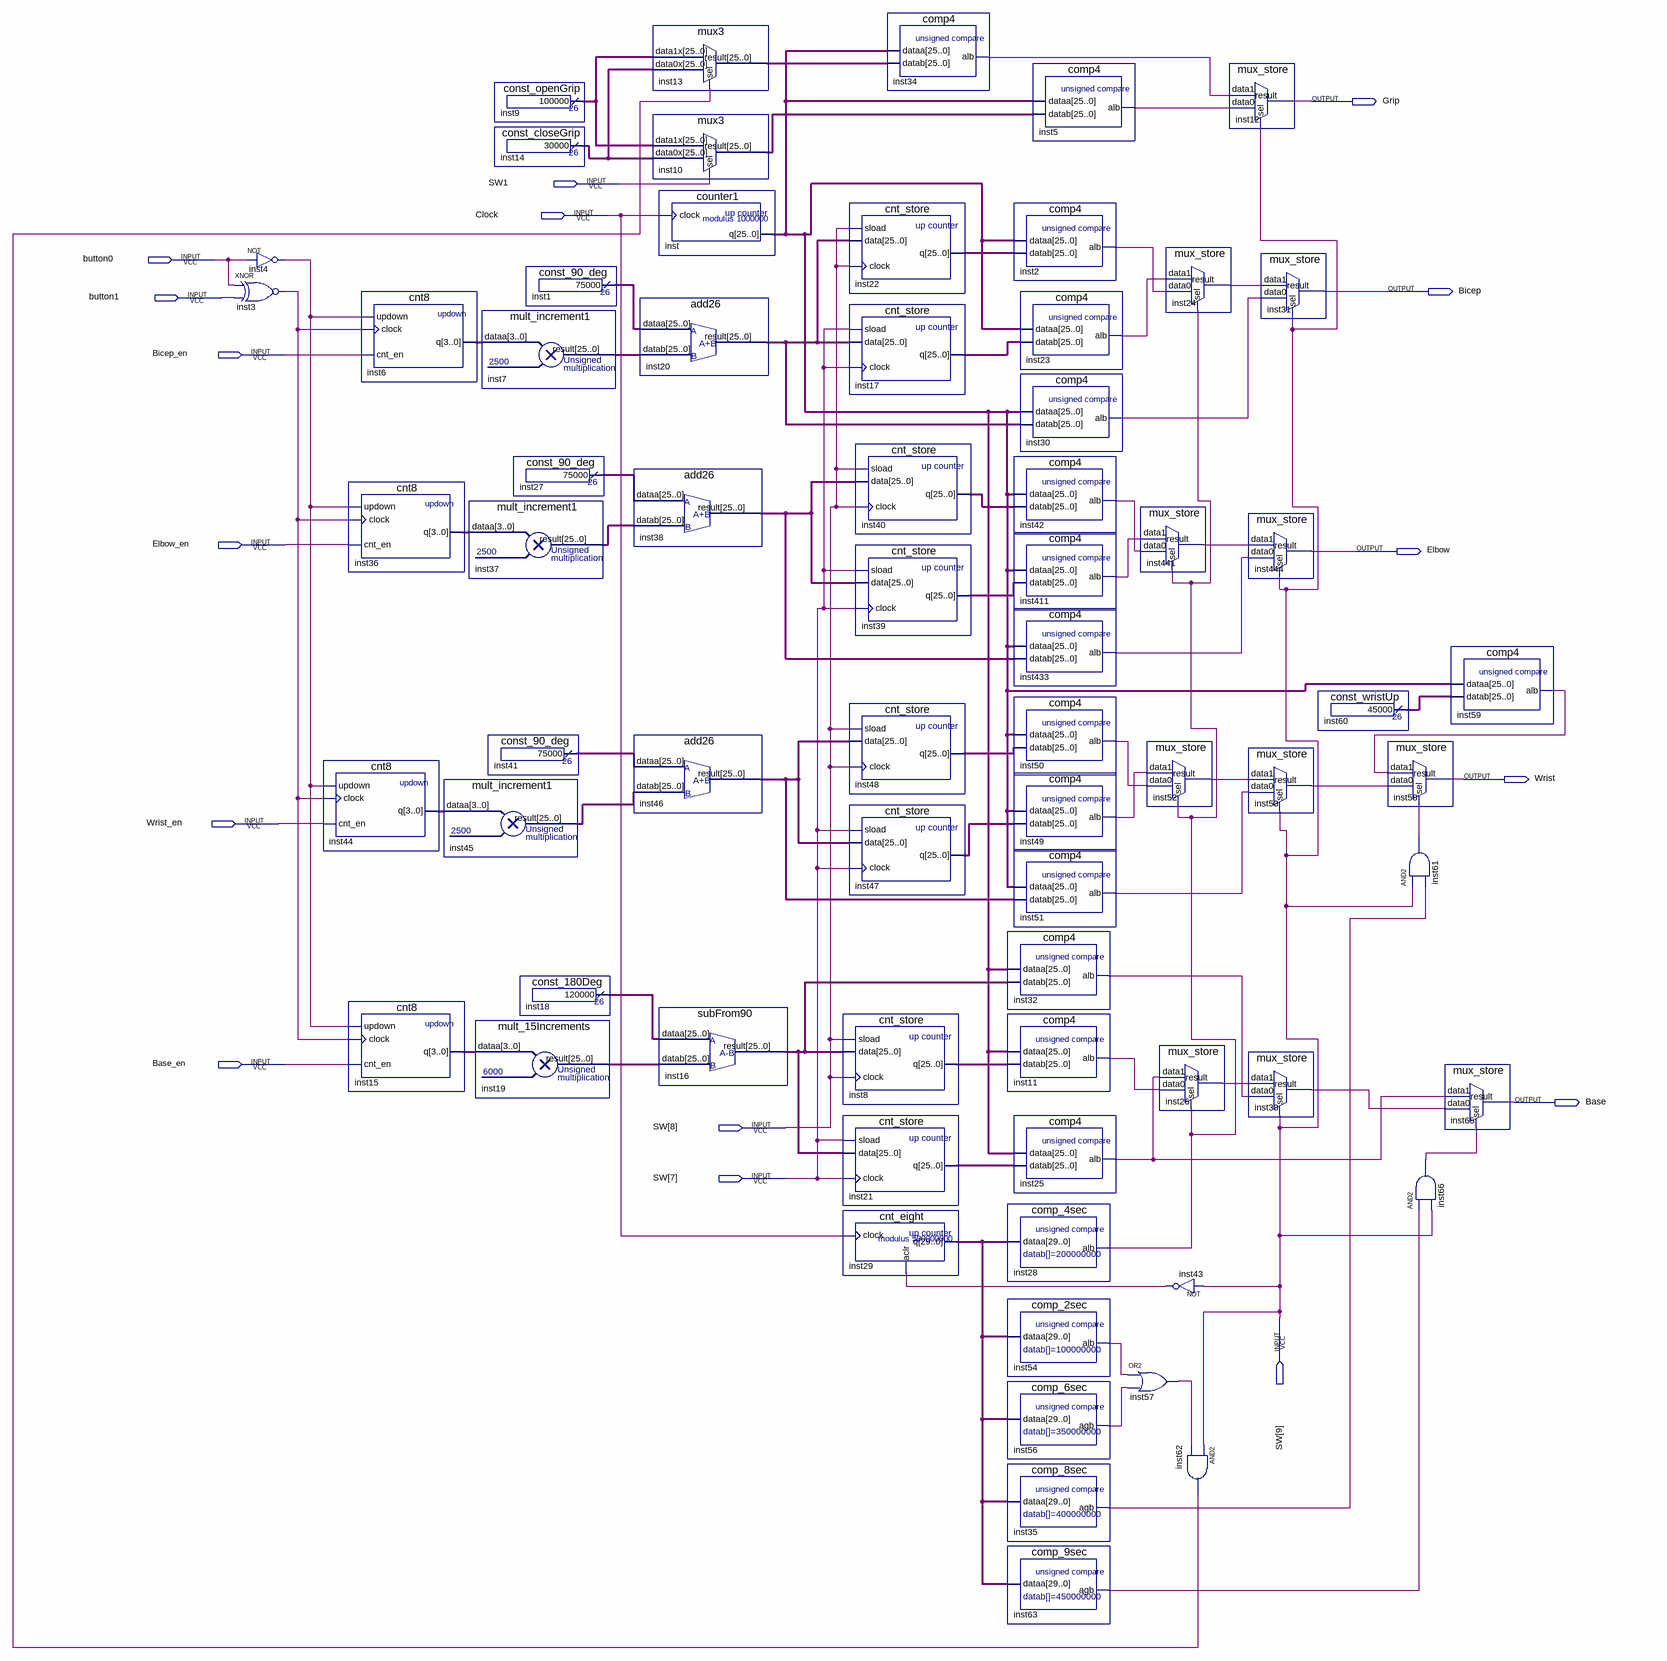
[diagram p0: schematic sheet]
// Quartus schematic pwm.bdf as structural Verilog: 69 symbols, 16 pins
module pwm (
  input  SW1,
  input  Clock,
  input  button0,
  input  button1,
  input  Bicep_en,
  input  Elbow_en,
  input  Wrist_en,
  input  Base_en,
  input  [9:7] SW,
  output Grip,
  output Bicep,
  output Elbow,
  output Wrist,
  output Base
);

  wire inst2_alb, inst3_out, inst4_out, inst5_alb, inst11_alb, inst23_alb, inst24_result, inst25_alb,
       inst26_result, inst28_alb, inst30_alb, inst32_alb, inst33_result, inst34_alb, inst35_agb, inst42_alb,
       inst43_out, inst49_alb, inst50_alb, inst51_alb, inst52_result, inst53_result, inst54_alb, inst56_agb,
       inst57_out, inst59_alb, inst61_out, inst62_out, inst63_agb, inst66_out, inst411_alb, inst433_alb,
       inst441_result;
  wire [3:0] inst6_q, inst15_q, inst36_q, inst44_q;
  wire [25:0] inst1_result, inst7_result, inst8_q, inst9_result, inst10_result, inst13_result, inst14_result,
       inst16_result, inst17_q, inst18_result, inst19_result, inst20_result, inst21_q, inst22_q,
       inst27_result, inst37_result, inst38_result, inst39_q, inst40_q, inst41_result, inst45_result,
       inst46_result, inst47_q, inst48_q, inst60_result, inst_q;
  wire [29:0] inst29_q;

  not inst4 (inst4_out, button0);
  xnor inst3 (inst3_out, button0, button1);
  cnt8 inst6 (.updown(inst4_out), .clock(inst3_out), .cnt_en(Bicep_en), .q(inst6_q));
  cnt8 inst36 (.updown(inst4_out), .clock(inst3_out), .cnt_en(Elbow_en), .q(inst36_q));
  cnt8 inst44 (.updown(inst4_out), .clock(inst3_out), .cnt_en(Wrist_en), .q(inst44_q));
  cnt8 inst15 (.updown(inst4_out), .clock(inst3_out), .cnt_en(Base_en), .q(inst15_q));
  mult_increment1 inst37 (.dataa(inst36_q), .result(inst37_result));
  mult_increment1 inst45 (.dataa(inst44_q), .result(inst45_result));
  const_openGrip inst9 (.result(inst9_result));
  const_closeGrip inst14 (.result(inst14_result));
  mult_increment1 inst7 (.dataa(inst6_q), .result(inst7_result));
  const_90_deg inst27 (.result(inst27_result));
  const_90_deg inst41 (.result(inst41_result));
  const_180Deg inst18 (.result(inst18_result));
  mult_15Increments inst19 (.dataa(inst15_q), .result(inst19_result));
  const_90_deg inst1 (.result(inst1_result));
  mux3 inst13 (.data1x(inst9_result), .data0x(inst14_result), .sel(inst62_out), .result(inst13_result));
  mux3 inst10 (.data1x(inst9_result), .data0x(inst14_result), .sel(SW1), .result(inst10_result));
  counter1 inst (.clock(Clock), .q(inst_q));
  add26 inst20 (.dataa(inst1_result), .datab(inst7_result), .result(inst20_result));
  add26 inst38 (.dataa(inst27_result), .datab(inst37_result), .result(inst38_result));
  add26 inst46 (.dataa(inst41_result), .datab(inst45_result), .result(inst46_result));
  subFrom90 inst16 (.dataa(inst18_result), .datab(inst19_result), .result(inst16_result));
  cnt_store inst22 (.sload(SW[8]), .data(inst20_result), .clock(SW[8]), .q(inst22_q));
  cnt_store inst17 (.sload(SW[7]), .data(inst20_result), .clock(SW[7]), .q(inst17_q));
  cnt_store inst40 (.sload(SW[8]), .data(inst38_result), .clock(SW[8]), .q(inst40_q));
  cnt_store inst39 (.sload(SW[7]), .data(inst38_result), .clock(SW[7]), .q(inst39_q));
  cnt_store inst48 (.sload(SW[8]), .data(inst46_result), .clock(SW[8]), .q(inst48_q));
  cnt_store inst47 (.sload(SW[7]), .data(inst46_result), .clock(SW[7]), .q(inst47_q));
  cnt_store inst8 (.sload(SW[8]), .data(inst16_result), .clock(SW[8]), .q(inst8_q));
  cnt_store inst21 (.sload(SW[7]), .data(inst16_result), .clock(SW[7]), .q(inst21_q));
  cnt_eight inst29 (.clock(Clock), .aclr(inst43_out), .q(inst29_q));
  comp4 inst34 (.dataa(inst_q), .datab(inst13_result), .alb(inst34_alb));
  comp4 inst2 (.dataa(inst_q), .datab(inst22_q), .alb(inst2_alb));
  comp4 inst23 (.dataa(inst_q), .datab(inst17_q), .alb(inst23_alb));
  comp4 inst30 (.dataa(inst_q), .datab(inst20_result), .alb(inst30_alb));
  comp4 inst42 (.dataa(inst_q), .datab(inst40_q), .alb(inst42_alb));
  comp4 inst411 (.dataa(inst_q), .datab(inst39_q), .alb(inst411_alb));
  comp4 inst433 (.dataa(inst_q), .datab(inst38_result), .alb(inst433_alb));
  comp4 inst50 (.dataa(inst_q), .datab(inst48_q), .alb(inst50_alb));
  comp4 inst49 (.dataa(inst_q), .datab(inst47_q), .alb(inst49_alb));
  comp4 inst51 (.dataa(inst_q), .datab(inst46_result), .alb(inst51_alb));
  comp4 inst32 (.dataa(inst_q), .datab(inst16_result), .alb(inst32_alb));
  comp4 inst11 (.dataa(inst_q), .datab(inst8_q), .alb(inst11_alb));
  comp4 inst25 (.dataa(inst_q), .datab(inst21_q), .alb(inst25_alb));
  comp_4sec inst28 (.dataa(inst29_q), .alb(inst28_alb));
  comp_2sec inst54 (.dataa(inst29_q), .alb(inst54_alb));
  comp_6sec inst56 (.dataa(inst29_q), .agb(inst56_agb));
  comp_8sec inst35 (.dataa(inst29_q), .agb(inst35_agb));
  comp_9sec inst63 (.dataa(inst29_q), .agb(inst63_agb));
  comp4 inst5 (.dataa(inst_q), .datab(inst10_result), .alb(inst5_alb));
  or inst57 (inst57_out, inst54_alb, inst56_agb);
  mux_store inst24 (.data1(inst23_alb), .data0(inst2_alb), .sel(inst28_alb), .result(inst24_result));
  mux_store inst441 (.data1(inst411_alb), .data0(inst42_alb), .sel(inst28_alb), .result(inst441_result));
  mux_store inst52 (.data1(inst49_alb), .data0(inst50_alb), .sel(inst28_alb), .result(inst52_result));
  mux_store inst26 (.data1(inst25_alb), .data0(inst11_alb), .sel(inst28_alb), .result(inst26_result));
  not inst43 (inst43_out, SW[9]);
  and inst62 (inst62_out, SW[9], inst57_out);
  mux_store inst12 (.data1(inst34_alb), .data0(inst5_alb), .sel(SW[9]), .result(Grip));
  mux_store inst31 (.data1(inst24_result), .data0(inst30_alb), .sel(SW[9]), .result(Bicep));
  mux_store inst444 (.data1(inst441_result), .data0(inst433_alb), .sel(SW[9]), .result(Elbow));
  mux_store inst53 (.data1(inst52_result), .data0(inst51_alb), .sel(SW[9]), .result(inst53_result));
  mux_store inst33 (.data1(inst26_result), .data0(inst32_alb), .sel(SW[9]), .result(inst33_result));
  const_wristUp inst60 (.result(inst60_result));
  mux_store inst58 (.data1(inst59_alb), .data0(inst53_result), .sel(inst61_out), .result(Wrist));
  and inst61 (inst61_out, SW[9], inst35_agb);
  and inst66 (inst66_out, inst63_agb, SW[9]);
  comp4 inst59 (.dataa(inst_q), .datab(inst60_result), .alb(inst59_alb));
  mux_store inst65 (.data1(inst25_alb), .data0(inst33_result), .sel(inst66_out), .result(Base));
endmodule
